# EAGLE schematic SchlapphutProjekt_v1_0 (EAGLE 8.5.0)
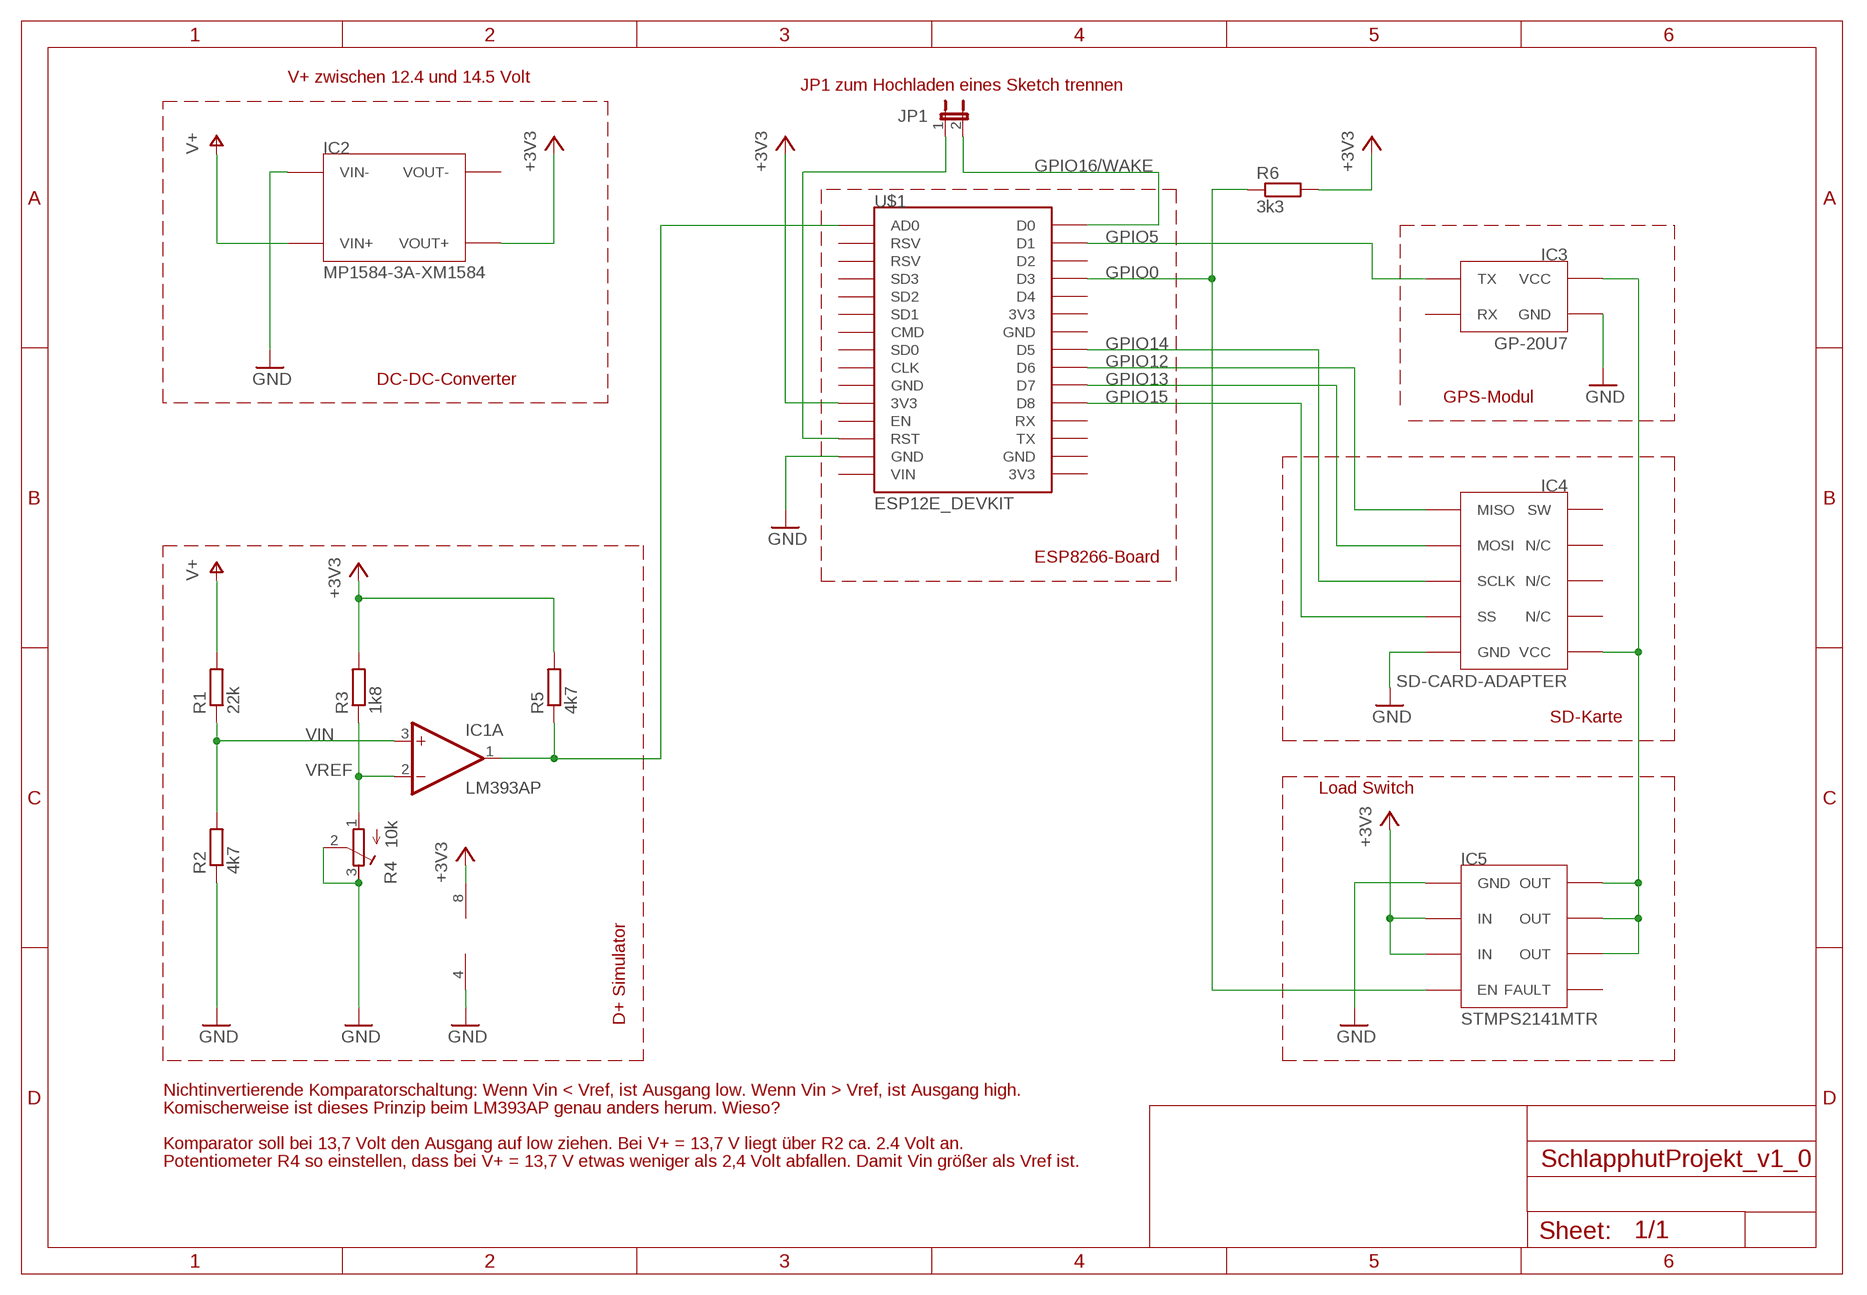
[diagram p0: schematic, sheet 1]

## Parts
IC1  LM393AP  LM393N  [DIL08]
IC2  MP1584-3A-XM1584  [KA278R33CTU]
IC3  GP-20U7  GY-GPS6MV2  [KA278R33CTU]
IC4  SD-CARD-ADAPTER  [SD-CARD-ADAPTER]
IC5  STMPS2141MTR  [STMPS2141MTR]
JP1  JP1 zum Hochladen eines Sketch trennen  JP1E  [JP1]
R1  22k  R-EU_0207/12  [0207/12]
R2  4k7  R-EU_0207/12  [0207/12]
R3  1k8  R-EU_0207/12  [0207/12]
R4  10k  R-TRIMM64Z  [RTRIM64Z]
R5  4k7  R-EU_0207/12  [0207/12]
R6  3k3  R-EU_0207/12  [0207/12]
U$1  ESP12E_DEVKIT  [ESP12E_DEVKIT]

## Nets
+3V3: IC1.8(P:V+) IC2.3(VOUT+) IC5.P$4(IN) IC5.P$5(IN) R3.2 R5.2 R6.2 U$1.3V3@0(3V3)
GND: IC1.4(P:V-) IC2.2(VIN-) IC3.4(GND) IC4.6(GND) IC5.P$3(GND) R2.1 R4.2(S) R4.3(E) U$1.GND@1(GND)
GPIO0: IC5.P$1(EN) R6.1 U$1.D3
GPIO5: IC3.3(TX) U$1.D1
GPIO12: IC4.10(MISO) U$1.D6
GPIO13: IC4.9(MOSI) U$1.D7
GPIO14: IC4.8(SCLK) U$1.D5
GPIO15: IC4.7(SS) U$1.D8
GPIO16/WAKE: JP1.2 U$1.D0
N$3: IC1.1(A:OUT) R5.1 U$1.AD0
N$6: IC3.1(VCC) IC4.5(VCC) IC5.P$6(OUT) IC5.P$7(OUT) IC5.P$8(OUT)
V+: IC2.1(VIN+) R1.2
VIN: IC1.3(A:+IN) R1.1 R2.2
VREF: IC1.2(A:-IN) R3.1 R4.1(A)
WAKE: JP1.1 U$1.RST
Unconnected: IC1.5(B:+IN) IC1.6(B:-IN) IC1.7(B:OUT) IC3.2(RX) IC4.1(SW) IC4.2(N/C) IC4.3(N/C) IC4.4(N/C) IC5.P$2(FAULT) U$1.3V3@1(3V3) U$1.3V3@2(3V3) U$1.CLK U$1.CMD U$1.D2 U$1.D4 U$1.EN U$1.GND@0(GND) U$1.GND@2(GND) U$1.GND@3(GND) U$1.RSV@0(RSV) U$1.RSV@1(RSV) U$1.RX U$1.SD0 U$1.SD1 U$1.SD2 U$1.SD3 U$1.TX U$1.VIN

## Notes on the sheet
- V+ zwischen 12.4 und 14.5 Volt
- DC-DC-Converter
- GPS-Modul
- ESP8266-Board
- SD-Karte
- Load Switch
- D+ Simulator
- Nichtinvertierende Komparatorschaltung: Wenn Vin < Vref, ist Ausgang low. Wenn Vin > Vref, ist Ausgang high.
- Komischerweise ist dieses Prinzip beim LM393AP genau anders herum. Wieso?
- Komparator soll bei 13,7 Volt den Ausgang auf low ziehen. Bei V+ = 13,7 V liegt über R2 ca. 2.4 Volt an.
- Potentiometer R4 so einstellen, dass bei V+ = 13,7 V etwas weniger als 2,4 Volt abfallen. Damit Vin größer als Vref ist.

## Power pins joined to a net without a drawn wire
VOUT-: IC2.4(VOUT-)

## Library data of the parts
IC1 = linear:LM393: COMPARATOR
IC2 = SchlapphutProjektLib:MP1584-3A-XM1584
IC3 = SchlapphutProjektLib:GY-GPS6MV2
IC4 = SchlapphutProjektLib:SD-CARD-ADAPTER
IC5 = SchlapphutProjektLib:STMPS2141MTR
JP1 = jumper:JP1E: JUMPER
R1-R3 R5 R6 = rcl:R-EU_: RESISTOR, European symbol; SPICEPREFIX: R
R4 = rcl:R-TRIMM: Trimm resistor; SPICEMODEL: X; SPICEPREFIXL: POT
U$1 = ESP12E_DEVKIT:ESP12E_DEVKIT: ESP12E DEVKIT BOARD